# Altium schematic sheet PLD_Sail_Latch-Indicator.SchDoc: Latch Indicator Interface for Sail
size A4; CheckedBy: (not checked); Author: P. Kuligowski
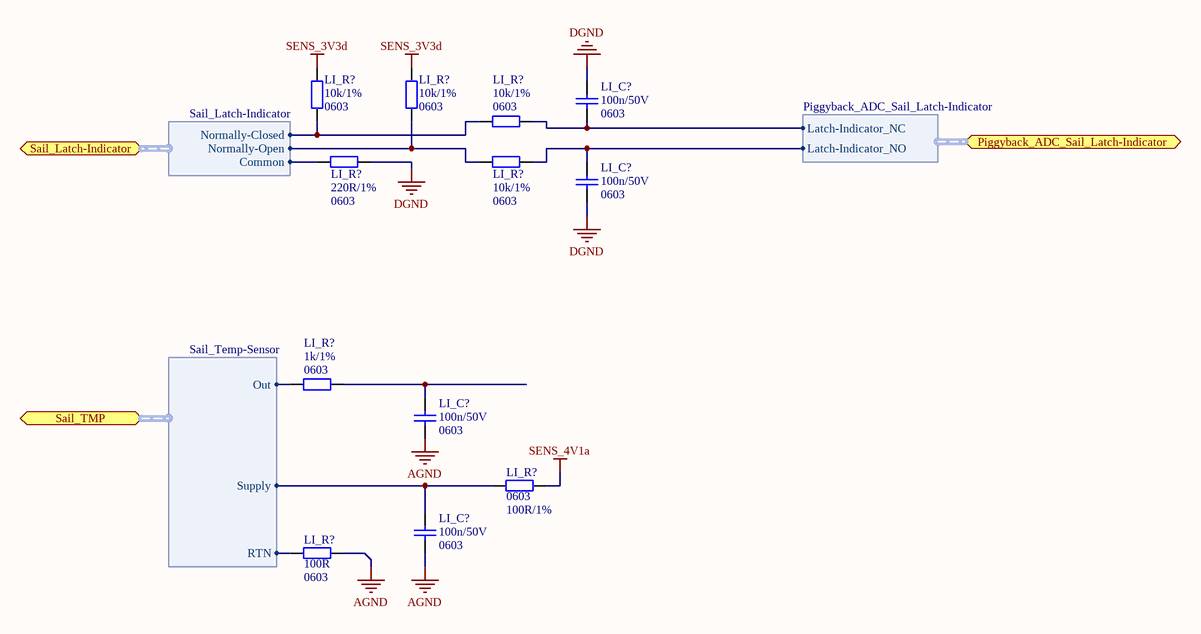
[diagram p0: PLD_Sail_Latch-Indicator.SchDoc]

## Parts
(Parts that share a designator on the sheet are numbered #1, #2 ... from top to bottom, then left to right.)
LI_C?#1  Package: 0603  [SMD_Capacitor_0603]  (hidden comment: 100n/50V)
LI_C?#2  Package: 0603  [SMD_Capacitor_0603]  (hidden comment: 100n/50V)
LI_C?#3  Package: 0603  [SMD_Capacitor_0603]  (hidden comment: 100n/50V)
LI_C?#4  Package: 0603  [SMD_Capacitor_0603]  (hidden comment: 100n/50V)
LI_R?#1  Package: 0603  [SMD_Resistor_0603]  (hidden comment: 10k/1%)
LI_R?#2  Package: 0603  [SMD_Resistor_0603]  (hidden comment: 10k/1%)
LI_R?#3  Package: 0603  [SMD_Resistor_0603]  (hidden comment: 10k/1%)
LI_R?#4  Package: 0603  [SMD_Resistor_0603]  (hidden comment: 220R/1%)
LI_R?#5  Package: 0603  [SMD_Resistor_0603]  (hidden comment: 10k/1%)
LI_R?#6  Package: 0603  [SMD_Resistor_0603]  (hidden comment: 1k/1%)
LI_R?#7  Package: 0603  [SMD_Resistor_0603]  (hidden comment: 100R/1%)
LI_R?#8  Package: 0603  [SMD_Resistor_0603]  (hidden comment: 100R)

## Ports
Piggyback_ADC_Sail_Latch-Indicator (harness Piggyback_ADC_Sail_Latch-Indicator), Sail_Latch-Indicator (harness Sail_Latch-Indicator), Sail_TMP (harness Sail_Temp-Sensor)

## Harnesses
Sail_Latch-Indicator: Common, Normally-Closed, Normally-Open
Piggyback_ADC_Sail_Latch-Indicator: Latch-Indicator_NC, Latch-Indicator_NO
Sail_Temp-Sensor: Supply, Out, RTN

## Nets
AGND: LI_C?#3.2 LI_C?#4.2 LI_R?#8.2
DGND: LI_C?#1.1 LI_C?#2.2 LI_R?#4.2
SENS_3V3d: LI_R?#1.1 LI_R?#2.1
SENS_4V1a: LI_R?#7.2
NetLI_C?#1_2: LI_C?#1.2 LI_R?#3.2 ; port Piggyback_ADC_Sail_Latch-Indicator.Latch-Indicator_NC
NetLI_C?#2_1: LI_C?#2.1 LI_R?#5.2 ; port Piggyback_ADC_Sail_Latch-Indicator.Latch-Indicator_NO
NetLI_C?#3_1: LI_C?#3.1 LI_R?#6.2
NetLI_C?#4_1: LI_C?#4.1 LI_R?#7.1 ; port Sail_TMP.Supply
NetLI_R?#1_2: LI_R?#1.2 LI_R?#3.1 ; port Sail_Latch-Indicator.Normally-Closed
NetLI_R?#2_2: LI_R?#2.2 LI_R?#5.1 ; port Sail_Latch-Indicator.Normally-Open
NetLI_R?#4_1: LI_R?#4.1 ; port Sail_Latch-Indicator.Common
NetLI_R?#6_1: LI_R?#6.1 ; port Sail_TMP.Out
NetLI_R?#8_1: LI_R?#8.1 ; port Sail_TMP.RTN

## Notes on the sheet
- Title:
- Project:
- Author:
- Model:
- Document Number:
- Checked by:
- Rev:
- Date:
- Approved by:
- Sheet:
- of
- File name:

## Library data of the parts
LI_C?#1-LI_C?#4 = Cer_C0603T104K5RALTU: Ceramic Cap Kemet COTS 100n/50V X7R 0603; Manufacturer: Kemet; ManufacturerPartNumber: C0603T104K5RALTU; Value: 100n/50V
LI_R?#1-LI_R?#3 LI_R?#5 = CRCW060310K0FKxxxx: 10k/1% Vishay CRCW 0603 Resistor. 100mW, 100ppm, 75V.; Manufacturer: Vishay; ManufacturerPartNumber: CRCW060310K0FKxxxx; Value: 10k/1%
LI_R?#4 = CRCW0603220RFKxxxx: 220R/1% Vishay CRCW 0603 Resistor. 100mW, 100ppm, 75V.; ManufacturerPartNumber: CRCW0603220RFKxxxx; Manufacturer: Vishay; Value: 220R/1%
LI_R?#6 = CRCW06031K00FKxxxx: 1k/1% Vishay CRCW 0603 Resistor. 100mW, 100ppm, 75V.; Manufacturer: Vishay; ManufacturerPartNumber: CRCW06031K00FKxxxx; Value: 1k/1%
LI_R?#7 = CRCW0603100RFKxxxx: 100R/1% Vishay CRCW 0603 Resistor. 100mW, 100ppm, 75V.; Manufacturer: Vishay; ManufacturerPartNumber: CRCW0603100RFKxxxx; Value: 100R/1%
LI_R?#8 = Res: Value: 100R